# EAGLE schematic CPU_Schematics (EAGLE 7.6.0)
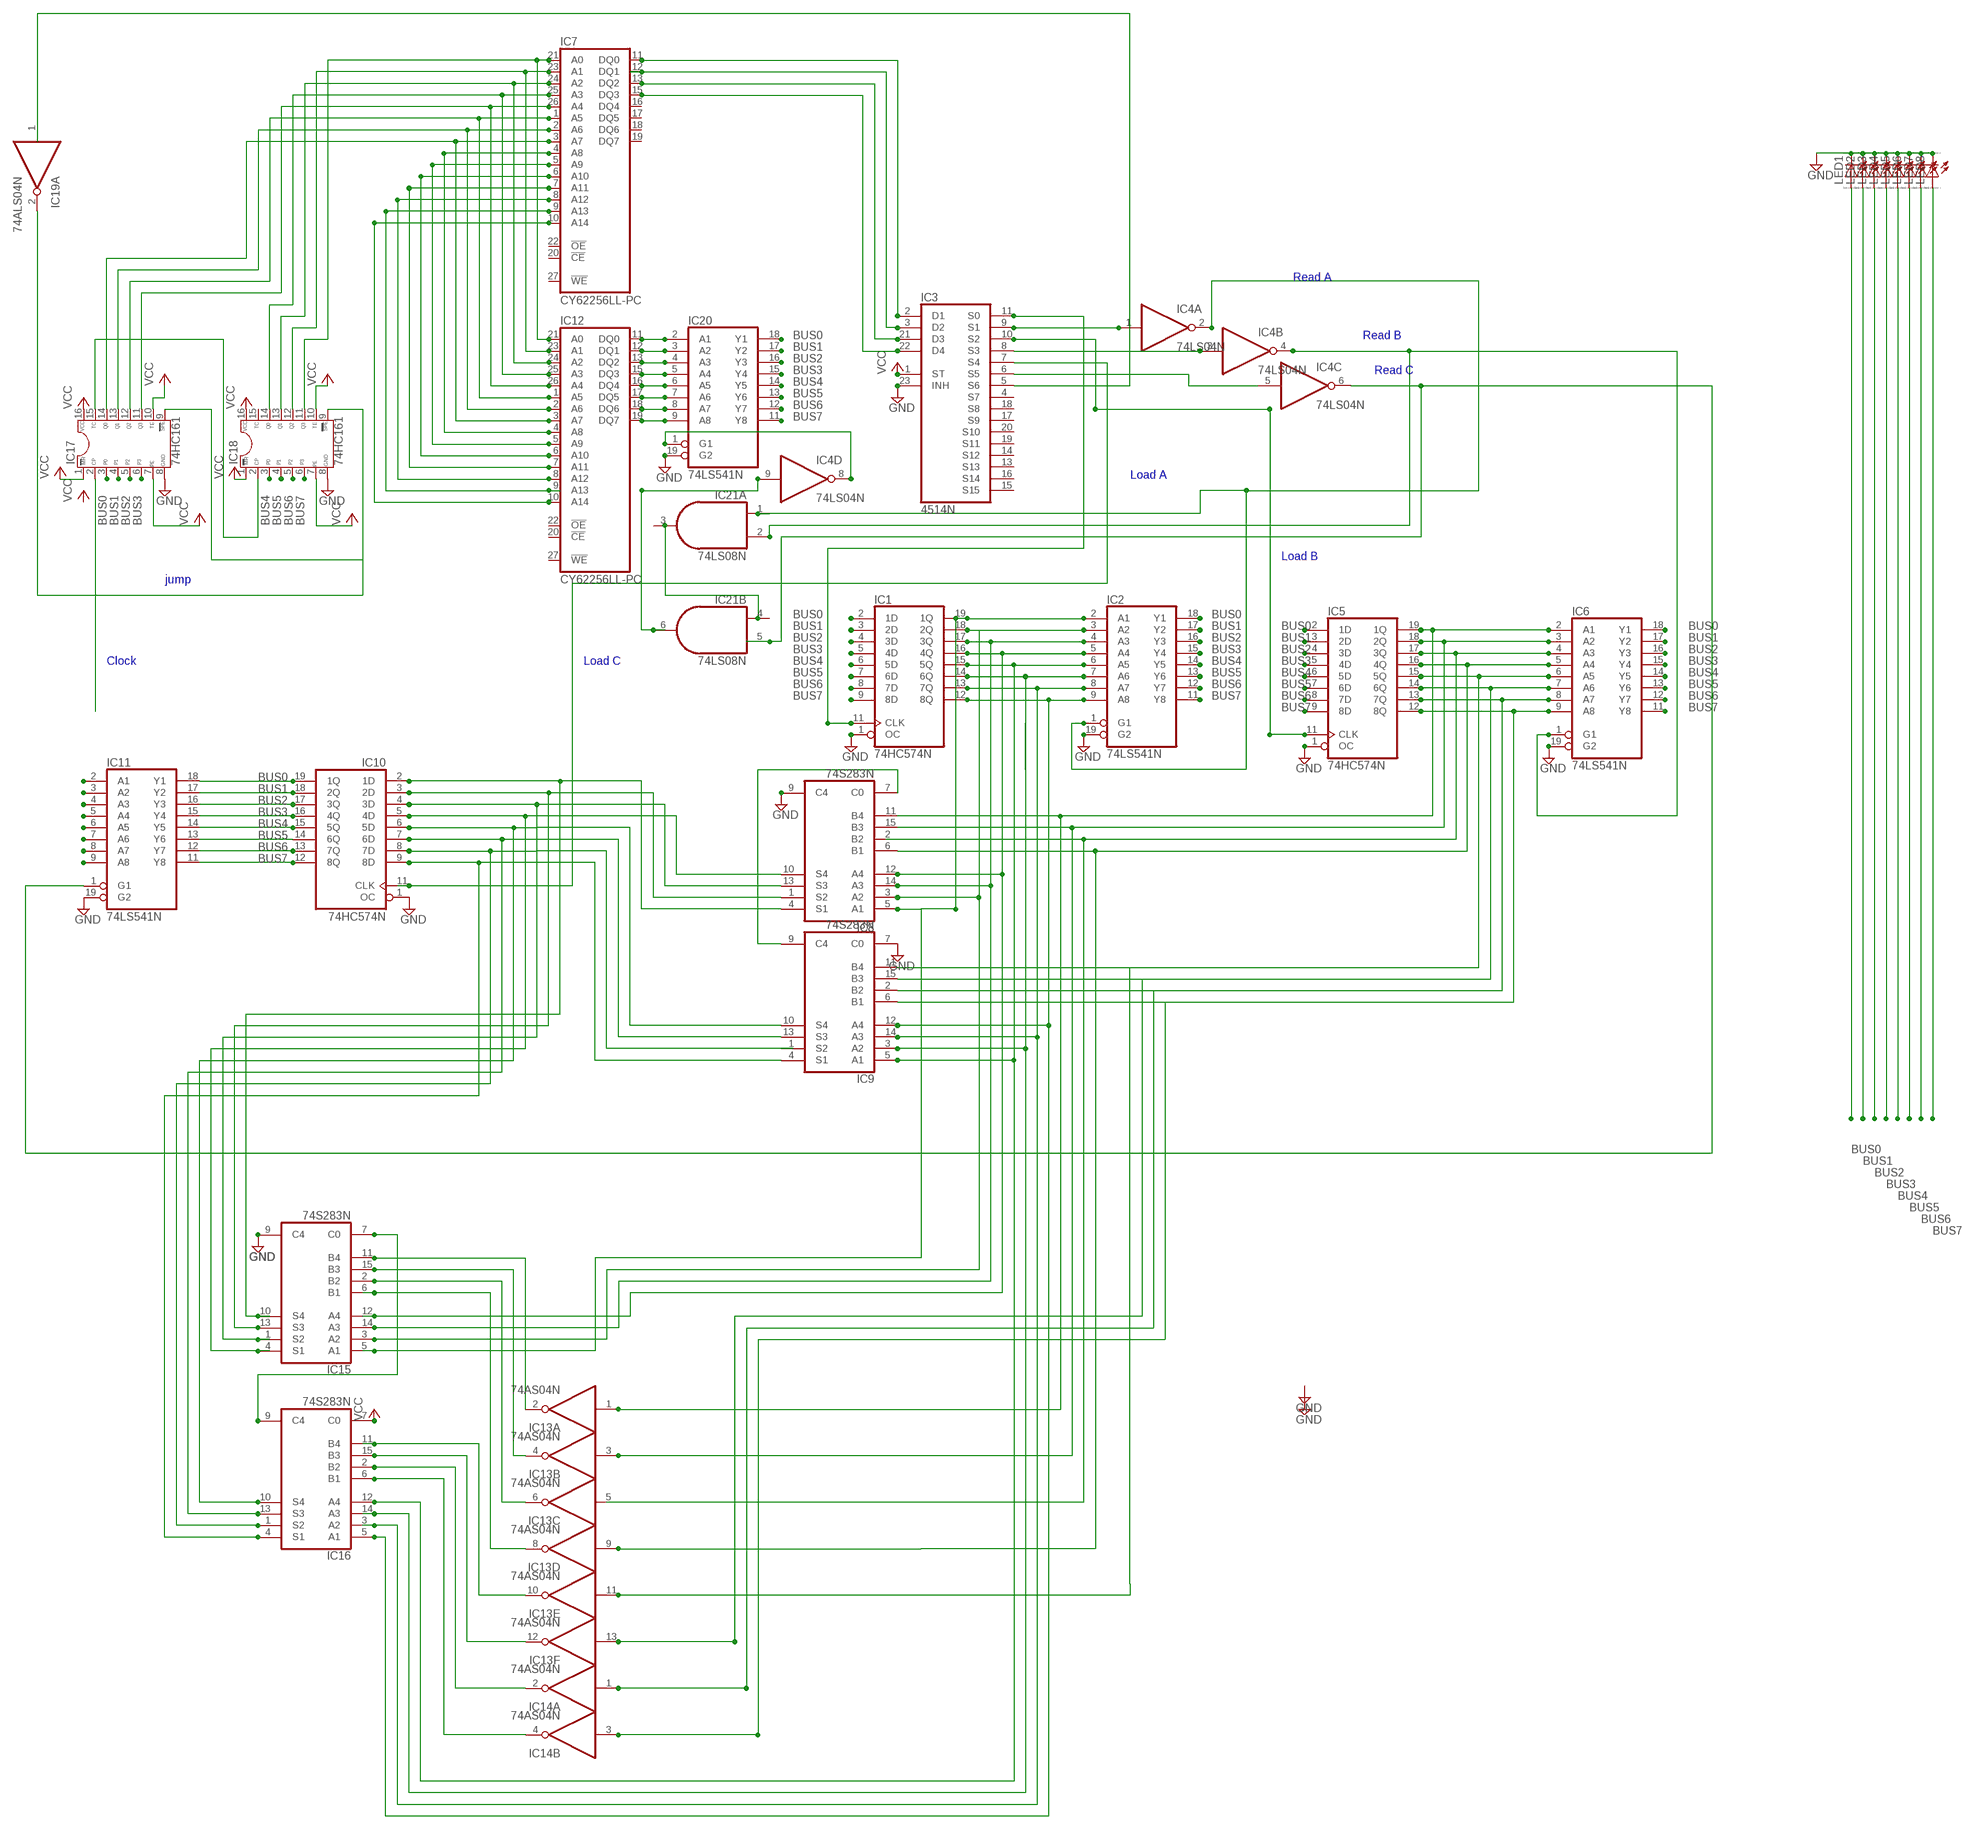
[diagram p0: schematic, sheet 1]

## Parts
IC1  74HC574N  [DIL20]
IC2  74LS541N  [DIL20]
IC3  4514N  [DIL24-6]
IC4  74LS04N  [DIL14]
IC5  74HC574N  [DIL20]
IC6  74LS541N  [DIL20]
IC7  CY62256LL-PC  [DIL28-6]
IC8  74S283N  [DIL16]
IC9  74S283N  [DIL16]
IC10  74HC574N  [DIL20]
IC11  74LS541N  [DIL20]
IC12  CY62256LL-PC  [DIL28-6]
IC13  74AS04N  [DIL14]
IC14  74AS04N  [DIL14]
IC15  74S283N  [DIL16]
IC16  74S283N  [DIL16]
IC17  DIL16  [DIL16]
IC18  DIL16  [DIL16]
IC19  74ALS04N  [DIL14]
IC20  74LS541N  [DIL20]
IC21  74LS08N  [DIL14]
LED1  LED_ELD260  [LED_LD260]
LED2  LED_ELD260  [LED_LD260]
LED3  LED_ELD260  [LED_LD260]
LED4  LED_ELD260  [LED_LD260]
LED5  LED_ELD260  [LED_LD260]
LED6  LED_ELD260  [LED_LD260]
LED7  LED_ELD260  [LED_LD260]
LED8  LED_ELD260  [LED_LD260]

## Nets
BUS0: IC1.2(1D) IC2.18(Y1) IC5.2(1D) IC6.18(Y1) IC11.2(A1) IC12.11(DQ0) IC17.3(P0) IC20.2(A1) IC20.18(Y1) LED1.A
BUS1: IC1.3(2D) IC2.17(Y2) IC3.10(S2) IC5.3(2D) IC5.11(CLK) IC6.17(Y2) IC11.3(A2) IC12.12(DQ1) IC17.4(P1) IC20.3(A2) IC20.17(Y2) LED2.A
BUS2: IC1.4(3D) IC2.16(Y3) IC5.4(3D) IC6.16(Y3) IC11.4(A3) IC12.13(DQ2) IC17.5(P2) IC20.4(A3) IC20.16(Y3) LED3.A
BUS3: IC1.5(4D) IC1.11(CLK) IC2.15(Y4) IC3.11(S0) IC5.5(4D) IC6.15(Y4) IC11.5(A4) IC12.15(DQ3) IC17.6(P3) IC20.5(A4) IC20.15(Y4) LED4.A
BUS4: IC1.6(5D) IC2.14(Y5) IC5.6(5D) IC6.14(Y5) IC11.6(A5) IC12.16(DQ4) IC18.3(P0) IC20.6(A5) IC20.14(Y5) LED5.A
BUS5: IC1.7(6D) IC2.13(Y6) IC5.7(6D) IC6.13(Y6) IC11.7(A6) IC12.17(DQ5) IC18.4(P1) IC20.7(A6) IC20.13(Y6) LED6.A
BUS6: IC1.8(7D) IC2.12(Y7) IC5.8(7D) IC6.12(Y7) IC11.8(A7) IC12.18(DQ6) IC18.5(P2) IC20.8(A7) IC20.12(Y7) LED7.A
BUS7: IC1.9(8D) IC2.11(Y8) IC5.9(8D) IC6.11(Y8) IC11.9(A8) IC12.19(DQ7) IC18.6(P3) IC20.9(A8) IC20.11(Y8) LED8.A
GND: IC1.1(OC) IC2.19(G2) IC3.23(INH) IC5.1(OC) IC6.19(G2) IC8.9(C4) IC9.7(C0) IC10.1(OC) IC11.19(G2) IC15.9(C4) IC17.8(GND) IC18.8(GND) IC20.19(G2) LED1.K(C) LED2.K(C) LED3.K(C) LED4.K(C) LED5.K(C) LED6.K(C) LED7.K(C) LED8.K(C)
N$1: IC1.19(1Q) IC2.2(A1) IC8.5(A1) IC15.5(A1)
N$2: IC1.18(2Q) IC2.3(A2) IC8.3(A2) IC15.3(A2)
N$3: IC1.17(3Q) IC2.4(A3) IC8.14(A3) IC15.14(A3)
N$4: IC1.16(4Q) IC2.5(A4) IC8.12(A4) IC15.12(A4)
N$5: IC1.15(5Q) IC2.6(A5) IC9.5(A1) IC16.12(A4)
N$6: IC1.14(6Q) IC2.7(A6) IC9.3(A2) IC16.14(A3)
N$7: IC1.13(7Q) IC2.8(A7) IC9.14(A3) IC16.3(A2)
N$8: IC1.12(8Q) IC2.9(A8) IC9.12(A4) IC16.5(A1)
N$9: IC3.2(D1) IC7.11(DQ0)
N$10: IC3.3(D2) IC7.12(DQ1)
N$11: IC3.21(D3) IC7.13(DQ2)
N$12: IC3.22(D4) IC7.15(DQ3)
N$13: IC3.9(S1) IC4.1(A:I)
N$14: IC2.1(G1) IC4.2(A:O) IC21.1(A:I0)
N$15: IC13.2(A:O) IC15.11(B4)
N$16: IC13.4(B:O) IC15.15(B3)
N$17: IC5.17(3Q) IC6.4(A3) IC8.2(B2)
N$18: IC5.16(4Q) IC6.5(A4) IC8.6(B1) IC13.9(D:I)
N$19: IC5.15(5Q) IC6.6(A5) IC9.11(B4) IC13.11(E:I)
N$20: IC5.14(6Q) IC6.7(A6) IC9.15(B3) IC13.13(F:I)
N$21: IC5.13(7Q) IC6.8(A7) IC9.2(B2) IC14.1(A:I)
N$22: IC13.5(C:I)
N$23: IC4.4(B:O) IC6.1(G1) IC21.2(A:I1)
N$24: IC3.8(S3) IC4.3(B:I)
N$26: IC8.7(C0) IC9.9(C4)
N$27: IC8.4(S1) IC10.2(1D) IC15.10(S4)
N$28: IC8.1(S2) IC10.3(2D) IC15.13(S3)
N$29: IC8.13(S3) IC10.4(3D) IC15.1(S2)
N$30: IC8.10(S4) IC10.5(4D) IC15.4(S1)
N$31: IC9.10(S4) IC10.6(5D) IC16.10(S4)
N$32: IC9.13(S3) IC10.7(6D) IC16.13(S3)
N$33: IC10.8(7D) IC16.1(S2)
N$34: IC9.4(S1) IC10.9(8D) IC16.4(S1)
N$35: IC10.19(1Q) IC11.18(Y1)
N$36: IC10.18(2Q) IC11.17(Y2)
N$37: IC10.17(3Q) IC11.16(Y3)
N$38: IC10.16(4Q) IC11.15(Y4)
N$39: IC10.15(5Q) IC11.14(Y5)
N$40: IC10.14(6Q) IC11.13(Y6)
N$41: IC10.13(7Q) IC11.12(Y7)
N$42: IC10.12(8Q) IC11.11(Y8)
N$43: IC3.7(S4) IC10.11(CLK)
N$44: IC3.6(S5) IC4.5(C:I)
N$45: IC4.6(C:O) IC11.1(G1) IC21.5(B:I1)
N$46: IC7.21(A0) IC12.21(A0) IC18.11(Q3)
N$47: IC7.23(A1) IC12.23(A1) IC18.12(Q2)
N$48: IC7.24(A2) IC12.24(A2) IC18.13(Q1)
N$49: IC7.25(A3) IC12.25(A3) IC18.14(Q0)
N$50: IC7.26(A4) IC12.26(A4) IC17.11(Q3)
N$51: IC7.1(A5) IC12.1(A5) IC17.12(Q2)
N$52: IC7.2(A6) IC12.2(A6) IC17.13(Q1)
N$53: IC7.3(A7) IC12.3(A7) IC17.14(Q0)
N$54: IC7.4(A8) IC12.4(A8)
N$55: IC7.5(A9) IC12.5(A9)
N$56: IC7.6(A10) IC12.6(A10)
N$57: IC7.7(A11) IC12.7(A11)
N$58: IC7.8(A12) IC12.8(A12)
N$59: IC7.9(A13) IC12.9(A13)
N$60: IC7.10(A14) IC12.10(A14)
N$61: IC5.18(2Q) IC6.3(A2) IC8.15(B3) IC13.3(B:I)
N$62: IC5.19(1Q) IC6.2(A1) IC8.11(B4) IC13.1(A:I)
N$63: IC13.6(C:O) IC15.2(B2)
N$64: IC13.8(D:O) IC15.6(B1)
N$65: IC13.10(E:O) IC16.11(B4)
N$66: IC13.12(F:O) IC16.15(B3)
N$67: IC5.12(8Q) IC6.9(A8) IC9.6(B1) IC14.3(B:I)
N$68: IC14.2(A:O) IC16.2(B2)
N$69: IC14.4(B:O) IC16.6(B1)
N$70: IC17.2(CP)
N$71: IC17.15(TC) IC18.2(CP)
N$72: IC3.5(S6)
N$73: IC17.9(|SPE) IC18.9(|SPE) IC19.2(A:O)
N$74: IC15.7(C0) IC16.9(C4)
N$75: IC4.9(D:I) IC21.6(B:O)
N$78: IC4.8(D:O) IC20.1(G1)
VCC: IC3.1(ST) IC16.7(C0) IC17.1(|MR) IC17.7(PE) IC17.10(TE) IC17.16(VCC) IC18.1(|MR) IC18.7(PE) IC18.10(TE) IC18.16(VCC)
Unconnected: IC3.4(S7) IC3.13(S13) IC3.14(S12) IC3.15(S15) IC3.16(S14) IC3.17(S9) IC3.18(S8) IC3.19(S11) IC3.20(S10) IC4.10(E:O) IC4.11(E:I) IC4.12(F:O) IC4.13(F:I) IC7.16(DQ4) IC7.17(DQ5) IC7.18(DQ6) IC7.19(DQ7) IC7.20(!CE) IC7.22(!OE) IC7.27(!WE) IC9.1(S2) IC12.20(!CE) IC12.22(!OE) IC12.27(!WE) IC14.5(C:I) IC14.6(C:O) IC14.8(D:O) IC14.9(D:I) IC14.10(E:O) IC14.11(E:I) IC14.12(F:O) IC14.13(F:I) IC18.15(TC) IC19.1(A:I) IC19.3(B:I) IC19.4(B:O) IC19.5(C:I) IC19.6(C:O) IC19.8(D:O) IC19.9(D:I) IC19.10(E:O) IC19.11(E:I) IC19.12(F:O) IC19.13(F:I) IC21.3(A:O) IC21.4(B:I0) IC21.8(C:O) IC21.9(C:I0) IC21.10(C:I1) IC21.11(D:O) IC21.12(D:I0) IC21.13(D:I1)

## Notes on the sheet
- Read A
- Read B
- Read C
- Load A
- Load B
- jump
- Clock | Load C

## Power pins joined to a net without a drawn wire
GND: IC1.10(GND) IC2.10(GND) IC4.7(P:GND) IC5.10(GND) IC6.10(GND) IC7.14(GND) IC8.8(GND) IC9.8(GND) IC10.10(GND) IC11.10(GND) IC12.14(GND) IC13.7(P:GND) IC14.7(P:GND) IC15.8(GND) IC16.8(GND) IC19.7(P:GND) IC20.10(GND) IC21.7(P:GND)
VCC: IC1.20(VCC) IC2.20(VCC) IC4.14(P:VCC) IC5.20(VCC) IC6.20(VCC) IC7.28(VCC) IC8.16(VCC) IC9.16(VCC) IC10.20(VCC) IC11.20(VCC) IC12.28(VCC) IC13.14(P:VCC) IC14.14(P:VCC) IC15.16(VCC) IC16.16(VCC) IC19.14(P:VCC) IC20.20(VCC) IC21.14(P:VCC)
VDD: IC3.24(VDD)
VSS: IC3.12(VSS)

## Library data of the parts
IC1 IC5 IC10 = 74xx-us:74*574: 8-bit D type FLIP FLOP bus driver
IC2 IC6 IC11 IC20 = 74xx-us:74*541: Octal BUFFER and LINE DRIVER, 3-state
IC3 = 45xx:4514: 4-bit latch 4-16 line DECODER
IC4 IC13 IC14 IC19 = 74xx-us:74*04: Hex INVERTER
IC7 IC12 = memory-sram:CY62256LL-?*: 256K (32K x 8) CMOS-Static RAM Source: http://download.cypress.com.edgesuite.net/design_resources/datasheets/contents/cy62256_8.pdf
IC8 IC9 IC15 IC16 = 74xx-us:74*283: 4-bit binary FULL ADDER, fast carry
IC17 IC18 = ic-package:DIL16: Dual In Line / Socket
IC21 = 74xx-us:74*08: Quad 2-input AND gate
LED1-LED8 = eagle-ltspice:LED_E: LED Source: http://www.osram.convergy.de Source: www.luxeon.com Source: www.kingbright.com; SPICEMODEL: NONE; SPICEPREFIX: D; SPICETYPE: diode